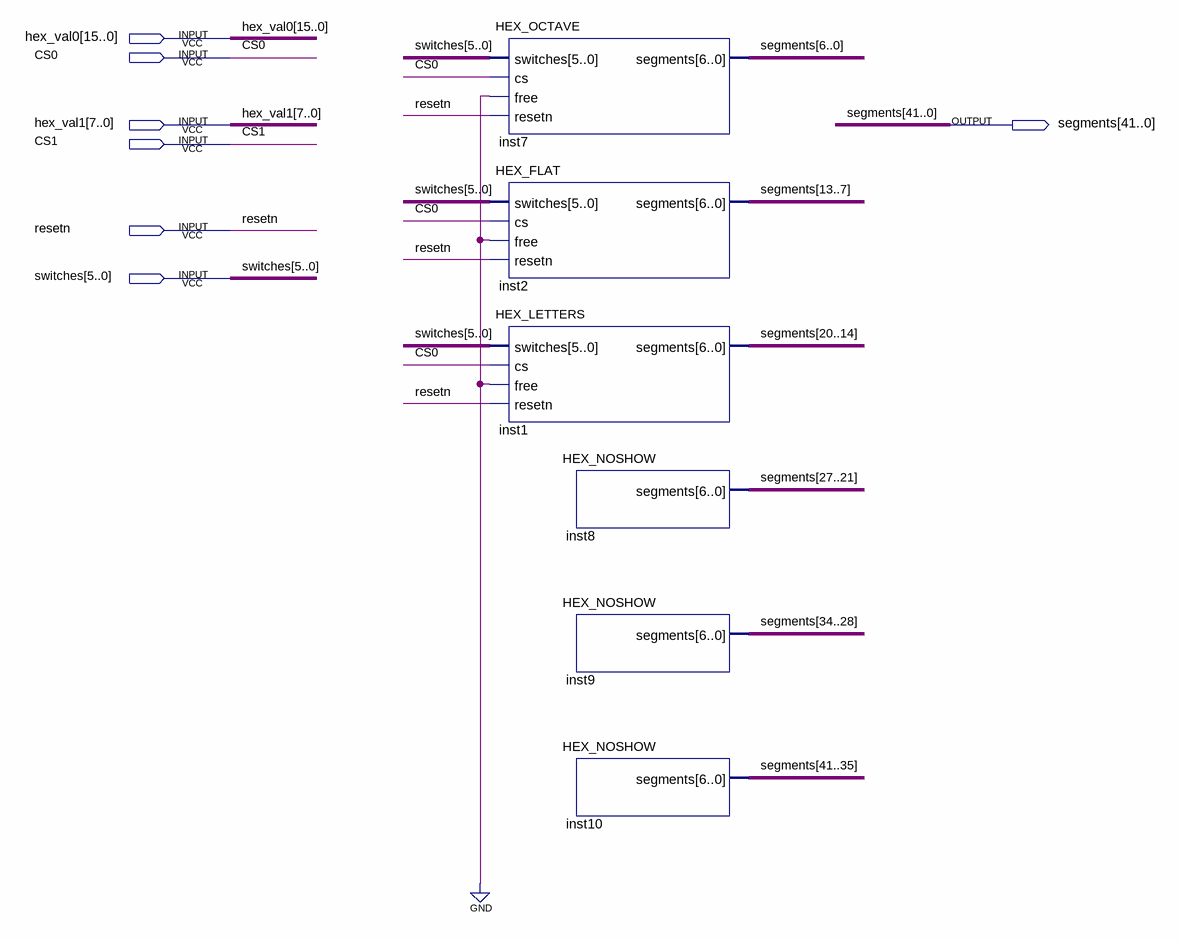
[diagram p0: schematic sheet]
// Quartus schematic HEX_DISP_6.bdf as structural Verilog: 6 symbols, 7 pins
module HEX_DISP_6 (
  input  [15:0] hex_val0,
  input  CS0,
  input  [7:0] hex_val1,
  input  CS1,
  input  resetn,
  input  [5:0] switches,
  output [41:0] segments
);

  HEX_OCTAVE inst7 (.switches(switches), .cs(CS0), .free(1'b0), .resetn(resetn), .segments(segments[6:0]));
  HEX_FLAT inst2 (.switches(switches), .cs(CS0), .free(1'b0), .resetn(resetn), .segments(segments[13:7]));
  HEX_LETTERS inst1 (.switches(switches), .cs(CS0), .free(1'b0), .resetn(resetn), .segments(segments[20:14]));
  HEX_NOSHOW inst8 (.segments(segments[27:21]));
  HEX_NOSHOW inst9 (.segments(segments[34:28]));
  HEX_NOSHOW inst10 (.segments(segments[41:35]));
endmodule
